# EAGLE design pcb1 (EAGLE 8.1.0)
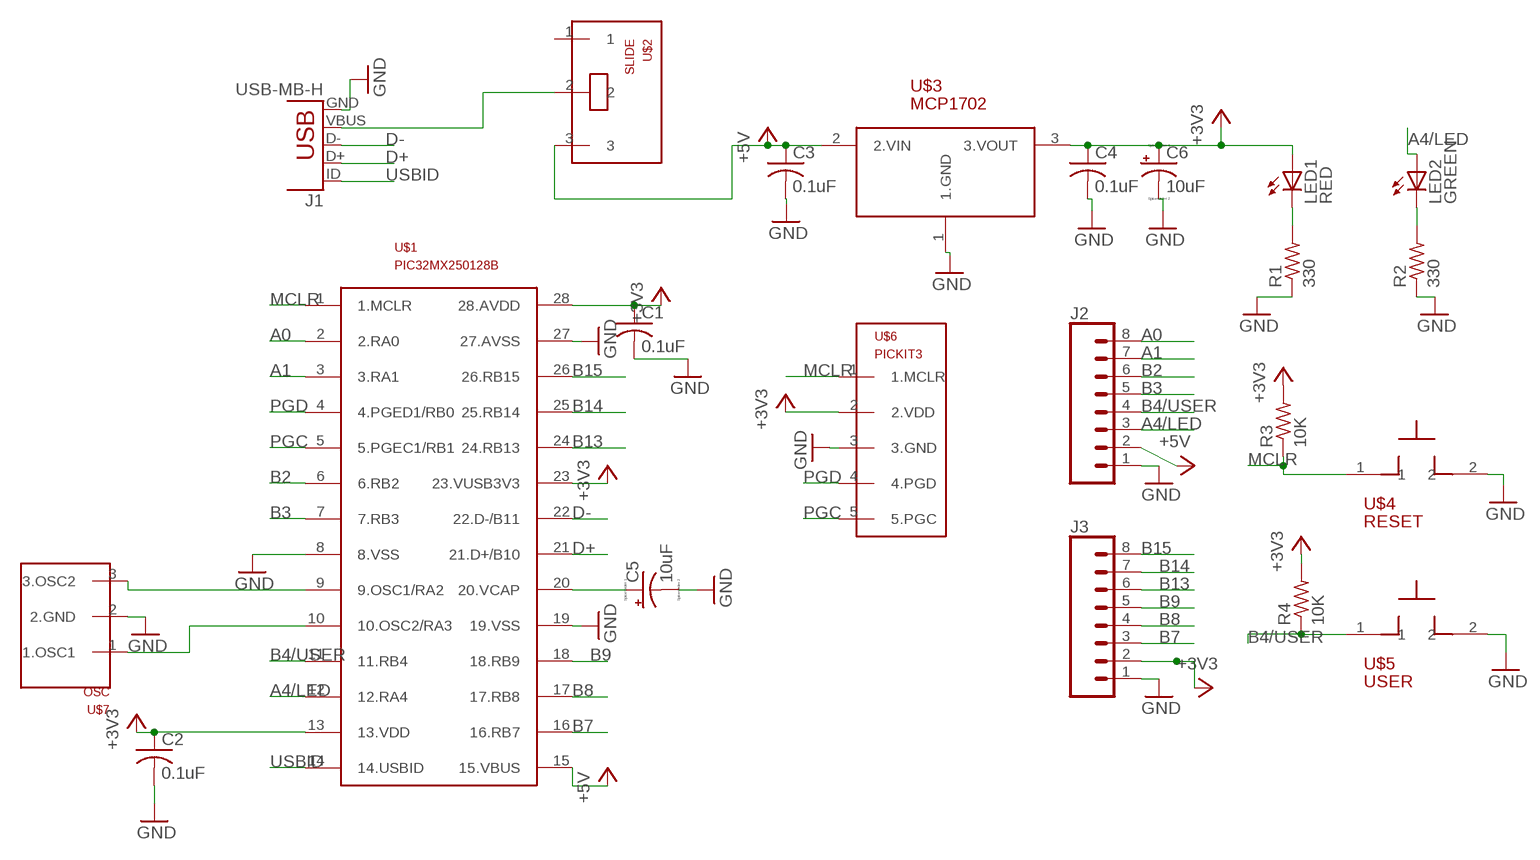
[diagram p0: schematic, sheet 1]

## Parts
C1  0.1uF  C-US050-050X075  [C050-050X075]
C2  0.1uF  C-US050-050X075  [C050-050X075]
C3  0.1uF  C-US050-050X075  [C050-050X075]
C4  0.1uF  C-US050-050X075  [C050-050X075]
C5  10uF  CPOL-USB45181A  [B45181A]
C6  10uF  CPOL-USB45181A  [B45181A]
J1  USB-MB-H  [USB-MB-H]
J2  CONN_08"  [1X08]
J3  CONN_08"  [1X08]
LED1  RED  LED3MM  [LED3MM]
LED2  GREEN  LED3MM  [LED3MM]
R1  330  R-US_0207/10  [0207/10]
R2  330  R-US_0207/10  [0207/10]
R3  10K  R-US_0207/10  [0207/10]
R4  10K  R-US_0207/10  [0207/10]
U$1  PIC32MX250128B  [DIL28-3]
U$2  SLIDE  [SLIDE]
U$3  MCP1702  [TO92]
U$4  RESET  PB  [PB]
U$5  USER  PB  [PB]
U$6  PICKIT3  [1X05]
U$7  OSC  [OSC]

## Nets
+3V3: C1.1 C2.1 C4.1 C6.+ J3.2 LED1.A R3.2 R4.2 U$1.13(13.VDD) U$1.23(23.VUSB3V3) U$1.28(28.AVDD) U$3.3(3.VOUT) U$6.2(2.VDD)
+5V: C3.1 J2.2 U$1.15(15.VBUS) U$2.3 U$3.2(2.VIN)
A0: J2.8 U$1.2(2.RA0)
A1: J2.7 U$1.3(3.RA1)
A4/LED: J2.3 LED2.A U$1.12(12.RA4)
B2: J2.6 U$1.6(6.RB2)
B3: J2.5 U$1.7(7.RB3)
B4/USER: J2.4 R4.1 U$1.11(11.RB4) U$5.1
B7: J3.3 U$1.16(16.RB7)
B8: J3.4 U$1.17(17.RB8)
B9: J3.5 U$1.18(18.RB9)
B13: J3.6 U$1.24(24.RB13)
B14: J3.7 U$1.25(25.RB14)
B15: J3.8 U$1.26(26.RB15)
D+: J1.D+ U$1.21(21.D+/B10)
D-: J1.D- U$1.22(22.D-/B11)
GND: C1.2 C2.2 C3.2 C4.2 C5.- C6.- J1.GND J2.1 J3.1 R1.1 R2.1 U$1.8(8.VSS) U$1.19(19.VSS) U$1.27(27.AVSS) U$3.1(1.GND) U$4.2 U$5.2 U$6.3(3.GND) U$7.2(2.GND)
MCLR: R3.1 U$1.1(1.MCLR) U$4.1 U$6.1(1.MCLR)
N$1: J1.VBUS U$2.2
N$2: U$1.9(9.OSC1/RA2) U$7.3(3.OSC2)
N$4: LED1.K(C) R1.2
N$5: U$1.10(10.OSC2/RA3) U$7.1(1.OSC1)
N$8: C5.+ U$1.20(20.VCAP)
N$42: LED2.K(C) R2.2
PGC: U$1.5(5.PGEC1/RB1) U$6.5(5.PGC)
PGD: U$1.4(4.PGED1/RB0) U$6.4(4.PGD)
USBID: J1.ID U$1.14(14.USBID)
Unconnected: U$2.1

## Library data of the parts
C1-C4 = HW2lib:C-US: CAPACITOR, American symbol
C5 C6 = HW2lib:CPOL-US: POLARIZED CAPACITOR, American symbol
J1 = HW2lib:USB: USB Connectors USB-B-PTH is fully proven SKU : PRT-00139/CONN-08278 USB-miniB is fully proven SKU : PRT-00587 USB-A-PCB is untested. USB-A-H is throughly reviewed, but untested. Spark Fun Electronics SKU : PRT-00437 USB-B-SMT is throughly reviewed, but untested. Needs silkscreen touching up. USB-A-S has not been used/tested USB-MB-H has not been used/tested USB-MICROB has been used. CONN-09505
J2 J3 = HW2lib:CONN_08: Multi connection point. Often used as Generic Header-pin footprint for 0.1 inch spaced/style header connections On any of the 0.1 inch spaced packages, you can populate with these: Break Away Headers - Straight <https://www.sparkfun.com/products/116> (PRT-00116) Break Away Male Headers - Right Angle <https://www.sparkfun.com/products/553> (PRT-00553) Female Headers <https://www.sparkfun.com/products/115> (PRT-00115) Break Away Headers - Machine Pin <https://www.sparkfun.com/products/117> (PRT-00117) Break Away Female Headers - Swiss Machine Pin <https://www.sparkfun.com/products/743> (PRT-00743) Arduino Stackable Header - 8 Pin <https://www.sparkfun.com/products/9279> (PRT-09279) For SCREWTERMINALS and SPRING TERMINALS visit here: Screw Terimnals on SparkFun.com <https://www.sparkfun.com/search/results?term=Screw+Terminals> (5mm/3.5mm/2.54mm spacing) This device is also useful as a general connection point to wire up your design to another part of your project. Our various solder wires solder well into these plated through hole pads. Hook-Up Wire - Assortment (Stranded, 22 AWG) <https://www.sparkfun.com/products/11375> (PRT-11375) Hook-Up Wire - Assortment (Solid Core, 22 AWG) <https://www.sparkfun.com/products/11367> (PRT-11367) View the entire wire category on our website here <https://www.sparkfun.com/categories/141> Special notes: Molex polarized connector foot print use with SKU : PRT-08231 with associated crimp pins and housings. 1MM SMD Version SKU: PRT-10208 NOTES ON THE VARIANTS LOCK and LOCK_LONGPADS... This footprint was designed to help hold the alignment of a through-hole component (i.e. 6-pin header) while soldering it into place. You may notice that each hole has been shifted either up or down by 0.005 of an inch from it's more standard position (which is a perfectly straight line). This slight alteration caused the pins (the squares in the middle) to touch the edges of the holes. Because they are alternating, it causes a "brace" to hold the component in place. 0.005 has proven to be the perfect amount of "off-center" position when using our standard breakaway headers. Although looks a little odd when you look at the bare footprint, once you have a header in there, the alteration is very hard to notice. Also,if you push a header all the way into place, it is covered up entirely on the bottom side.; PROD_ID: CONN-08438
LED1 LED2 = HW2lib:LED: LED OSRAM: - CHIPLED LG R971, LG N971, LY N971, LG Q971, LY Q971, LO R971, LY R971 LH N974, LH R974 LS Q976, LO Q976, LY Q976 LO Q996 - Hyper CHIPLED LW Q18S LB Q993, LB Q99A, LB R99A - SideLED LS A670, LO A670, LY A670, LG A670, LP A670 LB A673, LV A673, LT A673, LW A673 LH A674 LY A675 LS A676, LA A676, LO A676, LY A676, LW A676 LS A679, LY A679, LG A679 - Hyper Micro SIDELED® LS Y876, LA Y876, LO Y876, LY Y876 LT Y87S - SmartLED LW L88C, LW L88S LB L89C, LB L89S, LG L890 LS L89K, LO L89K, LY L89K LS L896, LA L896, LO L896, LY L896 - TOPLED LS T670, LO T670, LY T670, LG T670, LP T670 LSG T670, LSP T670, LSY T670, LOP T670, LYG T670 LG T671, LOG T671, LSG T671 LB T673, LV T673, LT T673, LW T673 LH T674 LS T676, LA T676, LO T676, LY T676, LB T676, LH T676, LSB T676, LW T676 LB T67C, LV T67C, LT T67C, LS T67K, LO T67K, LY T67K, LW E67C LS E67B, LA E67B, LO E67B, LY E67B, LB E67C, LV E67C, LT E67C LW T67C LS T679, LY T679, LG T679 LS T770, LO T770, LY T770, LG T770, LP T770 LB T773, LV T773, LT T773, LW T773 LH T774 LS E675, LA E675, LY E675, LS T675 LS T776, LA T776, LO T776, LY T776, LB T776 LHGB T686 LT T68C, LB T68C - Hyper Mini TOPLED® LB M676 - Mini TOPLED Santana® LG M470 LS M47K, LO M47K, LY M47K Source: http://www.osram.convergy.de LUXEON: - LUMILED® LXK2-PW12-R00, LXK2-PW12-S00, LXK2-PW14-U00, LXK2-PW14-V00 LXK2-PM12-R00, LXK2-PM12-S00, LXK2-PM14-U00 LXK2-PE12-Q00, LXK2-PE12-R00, LXK2-PE12-S00, LXK2-PE14-T00, LXK2-PE14-U00 LXK2-PB12-K00, LXK2-PB12-L00, LXK2-PB12-M00, LXK2-PB14-N00, LXK2-PB14-P00, LXK2-PB14-Q00 LXK2-PR12-L00, LXK2-PR12-M00, LXK2-PR14-Q00, LXK2-PR14-R00 LXK2-PD12-Q00, LXK2-PD12-R00, LXK2-PD12-S00 LXK2-PH12-R00, LXK2-PH12-S00 LXK2-PL12-P00, LXK2-PL12-Q00, LXK2-PL12-R00 Source: www.luxeon.com KINGBRIGHT: KA-3528ASYC Source: www.kingbright.com
R1-R4 = HW2lib:R-US_: RESISTOR, American symbol
U$1 = HW2lib:PIC32MX250128B
U$2 = HW2lib:SLIDE
U$3 = HW2lib:MCP1702
U$4 U$5 = HW2lib:PB
U$6 = HW2lib:PICKIT3
U$7 = HW2lib:OSC

## Board
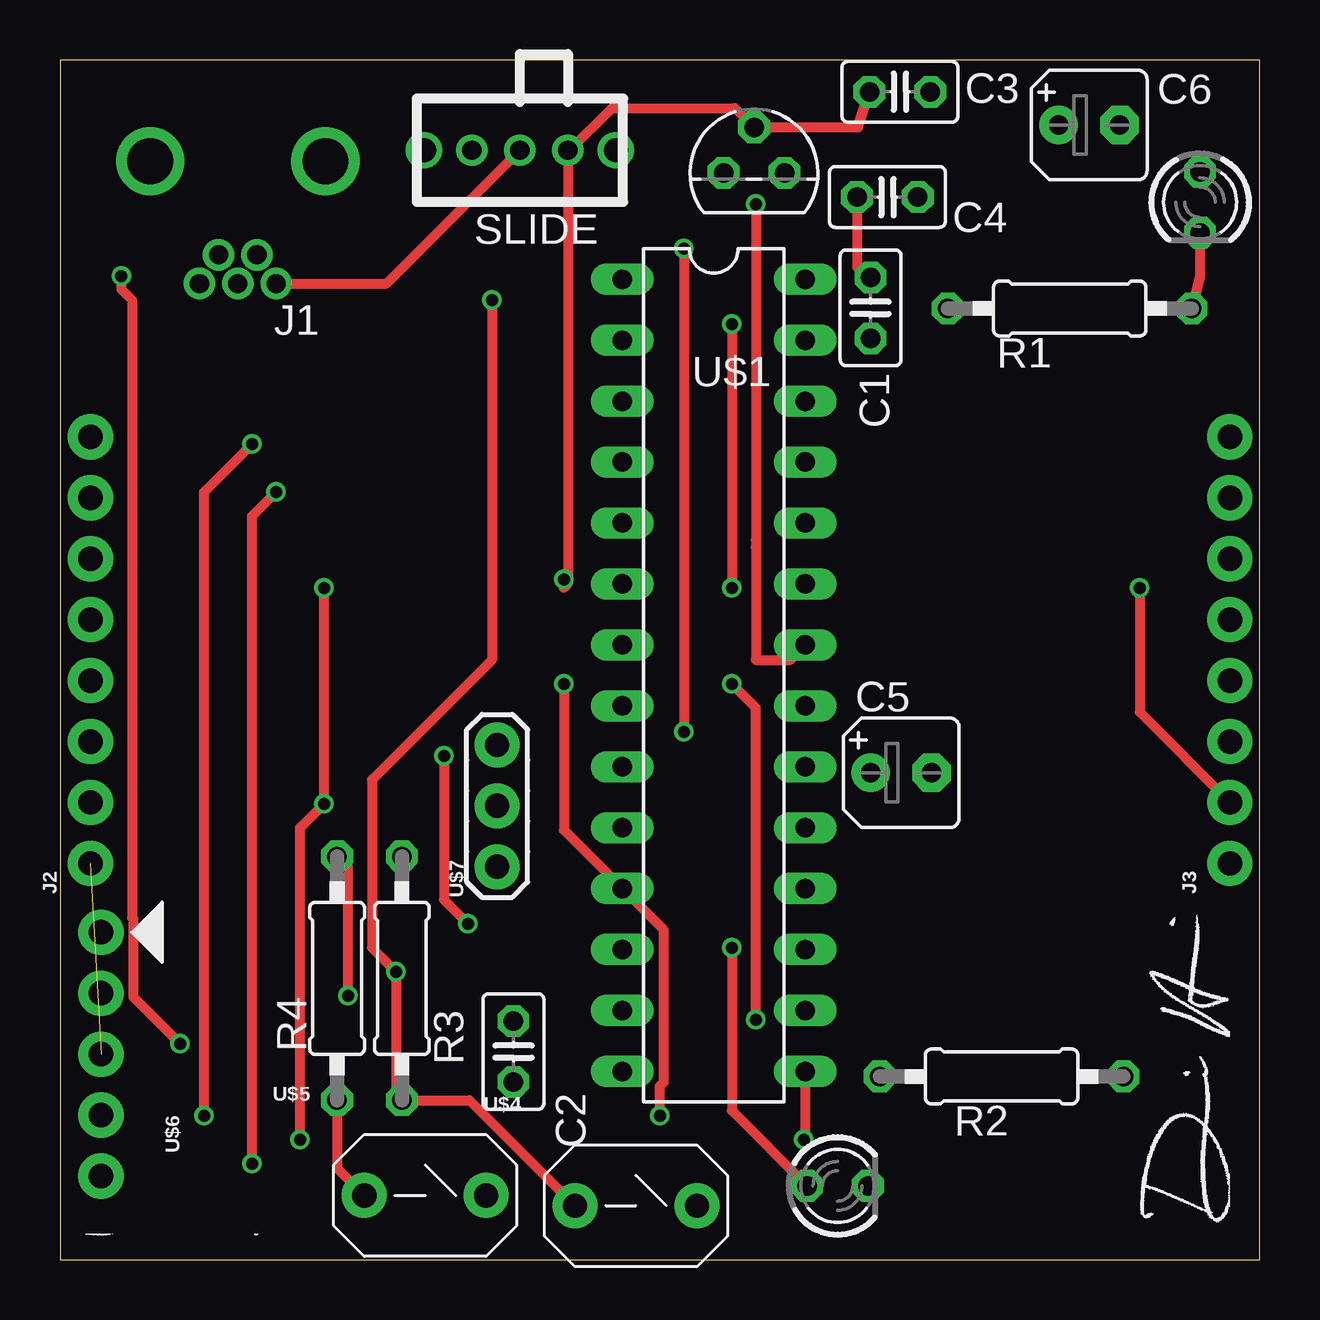
[diagram p1: board, top side]
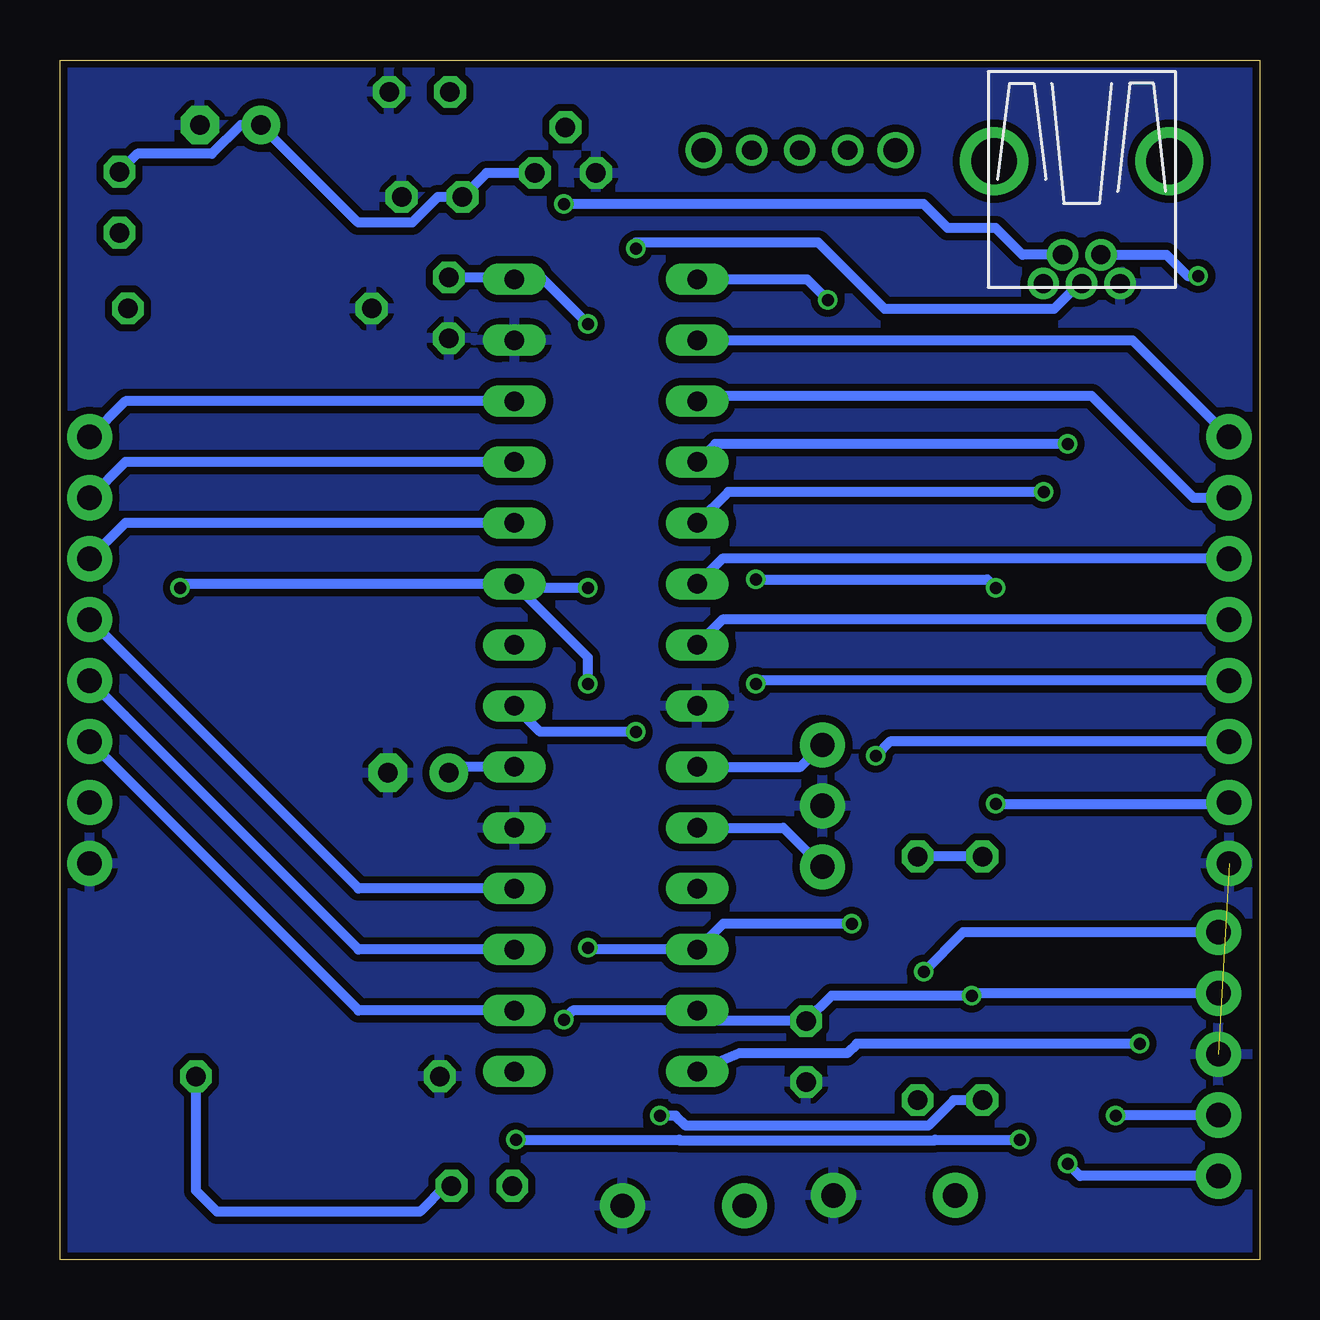
[diagram p2: board, bottom side, seen from below]

Size 50 x 50 mm. Coordinates in mm from the lower left corner, seen from the top.
Outline: 0,0 50,0 50,50 0,50 0,0
Copper layers (1*16): Top 0.035mm / dielectric 1.5mm / Bottom 0.035mm
Design rules "SeeedStudio_2layer_DRU_no_angle_20140221": minimum track width 6mil, minimum drill 12mil, track to track 6mil, track to pad 6mil, pad to pad 6mil, via to via 6mil, smd to smd 0mil, copper to edge 10mil, drill to drill 10mil, minimum pad ring 10mil, minimum via ring 6mil, stop-mask expansion 2mil, vias tented up to drill 100mil, thermal gap 10mil

### Footprints (pad centres in the part's own frame; a part is rotated, then mirrored left to right if it is on the bottom)
C025-025X050 = drill 0.813 octagon: 1 -1.27,0; 2 1.27,0
B45181A = drill 0.813 pad 1.6: + -1.27,0 | drill 0.813 pad 1.6 octagon: - 1.27,0
USB-MB-H = drill 0.8: D+ 5.1,0; D- 3.9,0.8; GND 5.1,-1.6; ID 3.9,-0.8; VBUS 5.1,1.6 | drill 1.9: P$6 0,-3.65; P$7 0,3.65
1X08 = drill 1.016 pad 1.88: 1 0,0; 2 2.54,0; 3 5.08,0; 4 7.62,0; 5 10.16,0; 6 12.7,0; 7 15.24,0; 8 17.78,0
LED3MM = drill 0.813 octagon: A -1.27,0; K 1.27,0
0207/10 = drill 0.813 octagon: 1 -5.08,0; 2 5.08,0
DIL28-3 = drill 0.813 long: 1 -16.51,-3.81; 2 -13.97,-3.81; 3 -11.43,-3.81; 4 -8.89,-3.81; 5 -6.35,-3.81; 6 -3.81,-3.81; 7 -1.27,-3.81; 8 1.27,-3.81; 9 3.81,-3.81; 10 6.35,-3.81; 11 8.89,-3.81; 12 11.43,-3.81; 13 13.97,-3.81; 14 16.51,-3.81; 15 16.51,3.81; 16 13.97,3.81; 17 11.43,3.81; 18 8.89,3.81; 19 6.35,3.81; 20 3.81,3.81; 21 1.27,3.81; 22 -1.27,3.81; 23 -3.81,3.81; 24 -6.35,3.81; 25 -8.89,3.81; 26 -11.43,3.81; 27 -13.97,3.81; 28 -16.51,3.81
SLIDE = drill 0.8: 1 -2,0; 2 0,0; 3 2,0 | drill 1: P$1 -4,0; P$2 4,0
TO92 = drill 0.813 pad 1.27 octagon: 1 -1.27,0; 2 0,1.905; 3 1.27,0
PB = drill 1.016 pad 1.88: 1 -2.54,0; 2 2.54,0
1X05 = drill 1.016 pad 1.88: 1 0,0; 2 2.54,0; 3 5.08,0; 4 7.62,0; 5 10.16,0
OSC = drill 1.016 pad 1.88: 1 -2.54,0; 2 0,0; 3 2.54,0

### Placement (x,y rotation side)
C1  0.1uF  [C025-025X050]  33.79,39.67 270 top
C2  0.1uF  [C025-025X050]  18.9,8.67 270 top
C3  0.1uF  [C025-025X050]  35.01,48.67 0 top
C4  0.1uF  [C025-025X050]  34.49,44.29 0 top
C5  35.06,20.29 0 top
C6  42.9,47.29 0 top
J1  7.41,45.78 270 top
J2  1.27,16.51 90 top
J3  48.77,16.51 90 top
LED1  47.52,44.07 270 top
LED2  32.41,3.07 0 top
R1  42.09,39.64 0 top
R2  39.25,7.63 0 top
R3  14.25,11.72 90 top
R4  11.55,11.72 90 top
U$1  27.25,24.35 270 top
U$2  19.17,46.24 0 top
U$3  28.93,45.29 0 top
U$4  24.01,2.24 0 top
U$5  15.22,2.67 0 top
U$6  1.71,13.64 270 top
U$7  18.22,18.91 90 top

### Tracks (layer width: path | path; a pad name or v marks a point on that pad's centre or on a via)
+3V3  (via drill 0.5)
  Top 0.406: C4.1 33.22,41.37 C1.1 | v45,28 45,22.82 J3.2 | v12,11 12,16.35 R4.2 | v29,10 29,23 v28,24 | v28,39 v28,28
  Bottom 0.406: LED1.A 46.78,46.08 43.67,46.08 42.46,47.29 C6.+ 37.56,43.22 35.32,43.22 34.25,44.29 C4.1 32.22,45.29 U$3.3 | C1.1 30.14,40.94 U$1.28 29.86,40.86 v28,39 | U$1.23 45,28.16 v45,28 | R4.2 R3.2 | U$6.2 11.9,11.1 v12,11 17.84,11 C2.1 23,9.94 U$1.13 28.62,10.38 v29,10 | v28,24 28,25.1 U$1.23 | v28,28 30.9,28 U$1.23
+5V  (via drill 0.5)
  Top 0.406: C3.1 33.27,47.2 U$3.2 28.12,48 23,48 21.24,46.24 U$2.3 21.17,28.17 21,28 v21,28.35 | v11,28 v11,19 10,18 v10,5 | U$1.15 31.06,5.06 v31,5
  Bottom 0.406: v21,28.35 11.35,28.35 v11,28 | v11,19 1.32,19 J2.2 | v31,5 24.2,5 24.16,4.96 13.56,4.96 13.52,5 v10,5
A0
  Bottom 0.406: U$1.2 5.3,38.32 J2.8
A1
  Bottom 0.406: J2.7 2.75,31.75 7,36 23.22,36 U$1.3
A4/LED  (via drill 0.5)
  Top 0.406: v28,13 28,6.21 LED2.A | v16,21 16,15 v17,14
  Bottom 0.406: v28,13 27.92,12.92 U$1.12 22.36,14 v17,14 | J2.3 15.41,21.59 v16,21
B2
  Bottom 0.406: J2.6 22.39,29.21 U$1.6
B3
  Bottom 0.406: J2.5 22.39,26.67 U$1.7
B4/USER  (via drill 0.5)
  Top 0.406: v21,24 21,17.9 U$1.11 25.17,13.73 25.17,7.4 25,7.23 v25,6 | R4.1 11.55,3.8 U$5.1
  Bottom 0.406: J2.4 20.87,24.13 v21,24 | R4.1 12.74,6.64 13.81,5.57 23.91,5.57 24.33,6 v25,6
B7
  Bottom 0.406: U$1.16 37.56,10.38 J3.3
B8
  Bottom 0.406: U$1.17 37.56,12.92 J3.4
B9
  Bottom 0.406: U$1.18 37.56,15.46 J3.5
B13
  Bottom 0.406: U$1.24 47.28,30.7 J3.6
B14
  Bottom 0.406: U$1.25 47.28,33.24 J3.7
B15
  Bottom 0.406: U$1.26 47.28,35.78 J3.8
D+  (via drill 0.5)
  Top 0.406: v26,42.14 v26,22
  Bottom 0.406: J1.D+ 7.51,40.68 8.57,39.62 15.62,39.62 18.39,42.39 26,42.39 v26,42.14 | v26,22 29.98,22 U$1.21
D-  (via drill 0.5)
  Top 0.406: v29,44 29,30 29,29.68 29,25 30.44,25 U$1.22
  Bottom 0.406: J1.D- 9.88,41.88 11,43 13,43 14,44 v29,44
GND  (1 unrouted)
  pour Bottom (isolate 0.305): 0,50 0,0 50,0 50,50
MCLR  (via drill 0.5)
  Top 0.406: U$4.1 17.07,6.64 R3.1 14,6.89 v14,12 13,13 13,20 18,25 v18,40
  Bottom 0.406: U$6.1 12.36,13.64 v14,12 | U$1.1 18.86,40.86 v18,40
N$1
  Top 0.406: J1.VBUS 13.61,40.68 U$2.2
N$2
  Bottom 0.406: U$1.9 19.13,20.54 U$7.3
N$4
  Top 0.406: LED1.K 47.52,40.99 R1.2
N$5
  Bottom 0.406: U$1.10 19.85,18 U$7.1
N$8
  Bottom 0.406: U$1.20 33.54,20.54 C5.+
N$42
  Bottom 0.406: LED2.K 33.93,3.07 35,2 43.45,2 44.32,2.87 R2.2
PGC  (via drill 0.5)
  Top 0.406: v8,4 8,31 v9,32
  Bottom 0.406: U$6.5 7.48,3.48 v8,4 | v9,32 22.14,32 U$1.5
PGD  (via drill 0.5)
  Top 0.406: v6,6 6,32 v8,34
  Bottom 0.406: U$6.4 5.98,6.02 v6,6 | v8,34 22.68,34 U$1.4
USBID  (via drill 0.5)
  Top 0.406: v2.56,41 2.56,40.44 3,40 3,14.25 3.06,14.2 3.06,10.94 v5,9
  Bottom 0.406: J1.ID 3.88,41.88 3,41 v2.56,41 | v5,9 16.79,9 17.19,8.6 21.68,8.6 U$1.14